# Altium schematic sheet DSO_Front.SchDoc: Schematic_Name
size A4; CompanyName: University of Melbourne; Engineer: Your Name Here; DocumentNumber: 1; Revision: 0.1; SheetNumber: 1; SheetTotal: 1; Title_Project: Project_Title; StudentNo: Student No.
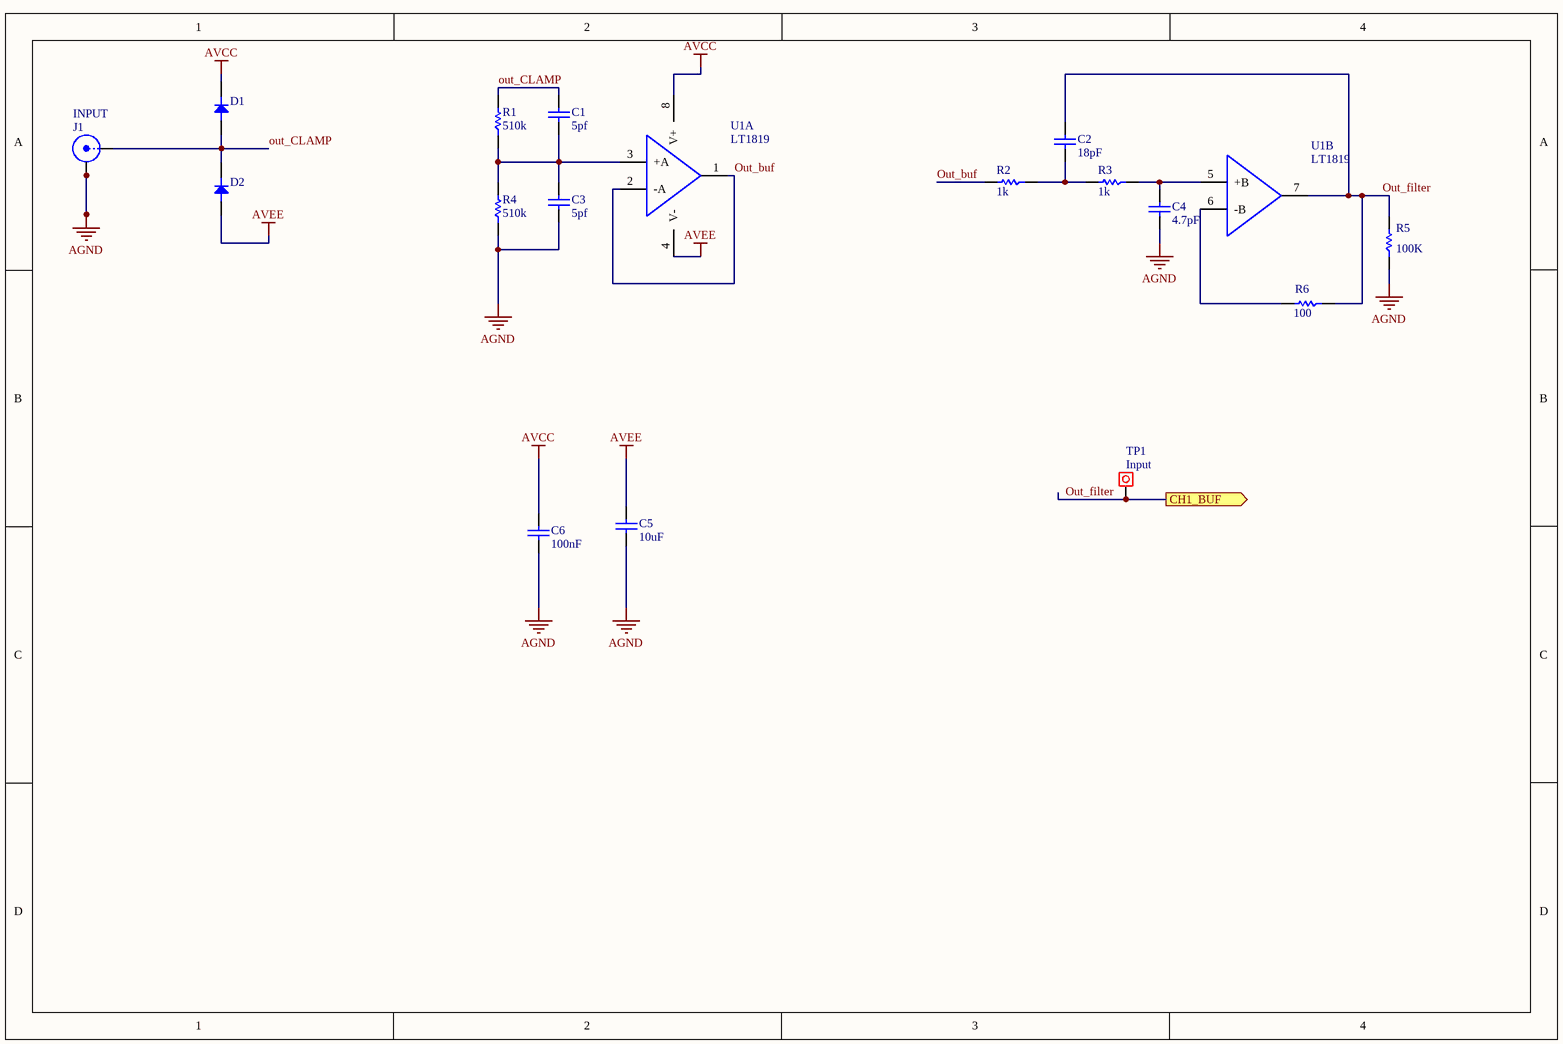
[diagram p0: DSO_Front.SchDoc]

## Parts
C1  5pf  [0805C]
C2  18pF  [0805C]
C3  5pf  [0805C]
C4  4.7pF  [0805C]
C5  10uF  [0805C]
C6  100nF  [0805C]
D1  Diode  [SOD-123]  (value not drawn)
D2  Diode  [SOD-123]  (value not drawn)
J1  INPUT  [BNC_VERT]
R1  510k  [0805]
R2  1k  [0805]
R3  1k  [0805]
R4  510k  [0805]
R5  100K  [0805]
R6  100  [0805]
TP1  INPUT  [Testpoin]
U1  LT1819  [MSOP-8]  (parts A,B of 2)

## Ports
CH1_BUF (out)

## Nets
AGND: C3.2 C4.2 C5.2 C6.2 J1.2(Y) J1.3(Y) J1.4(Y) J1.5(Y) R4.1 R5.1
AVCC: C6.1 D1.K U1.8(V+)
AVEE: C5.1 D2.A U1.4(V-)
Out_buf: R2.2 U1.1(OUTA) U1.2(-A)
out_CLAMP: C1.1 D1.A D2.K J1.1(X) R1.2
Out_filter: C2.1 R5.2 R6.1 TP1.1 U1.7(OUTB) ; port CH1_BUF
NetC1_2: C1.2 C3.1 R1.1 R4.2 U1.3(+A)
NetC2_2: C2.2 R2.1 R3.2
NetC4_1: C4.1 R3.1 U1.5(+B)
NetR6_2: R6.2 U1.6(-B)

## Library data of the parts
C1-C6 = C: Capacitor; Reviewed by: RM - 2018/08/05; Revision: July-2002: Re-released for DXP Platform.; Supplier 1: *; Supplier Part Number 1: *
  C1 C3: Value: 5pf
  C2: Value: 18pF
  C4: Value: 4.7pF
  C5: Value: 10uF
  C6: Value: 100nF
D1 D2 = D: Reviewed by: RM - 2018/08/05; Revision: July-2002: Re-released for DXP Platform.; Supplier 1: *; Supplier Part Number 1: *
J1 = BNC: BNC Straight; Reviewed by: RM - 2018/08/05; Supplier Part Number 1: A97581-ND; Supplier 1: Digi-Key
R1-R6 = R: Resistor; Reviewed by: RM - 2018/08/05; Supplier 1: *; Suppler Part Number 1: *
  R1 R4: Value: 510k
  R2 R3: Value: 1k
  R5: Value: 100K
  R6: Value: 100
TP1 = Test Point: Pad; Value: Input
U1 = LT1819: OpAmp High Frequency Dual; Reviewed by: RM - 2018/08/05; Supplier 1: Digi-Key; Supplier Part Number 1: LT1819CMS8#PBF-ND